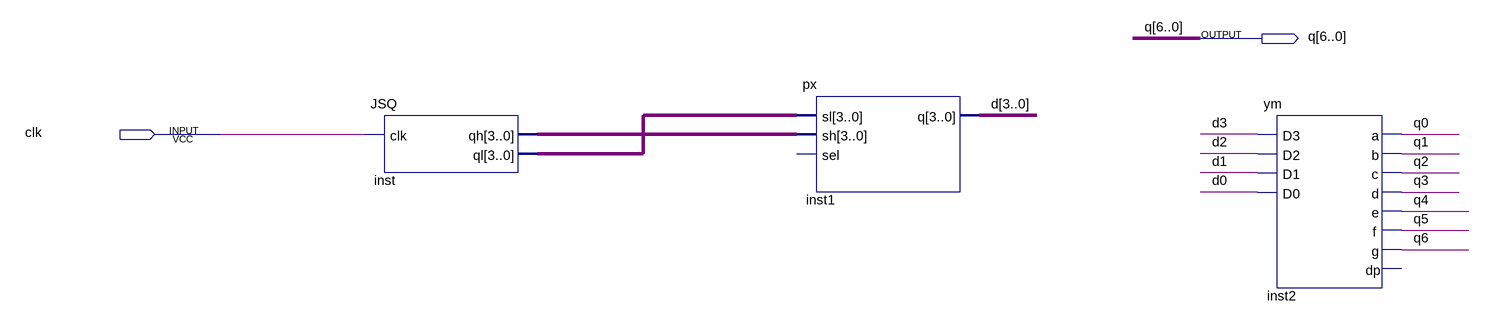
[diagram p0: schematic sheet]
// Quartus schematic digital_tube.bdf as structural Verilog: 3 symbols, 2 pins
module digital_tube (
  input  clk,
  output [6:0] q
);

  wire [3:0] d, inst_qh, inst_ql;

  JSQ inst (.clk(clk), .qh(inst_qh), .ql(inst_ql));
  px inst1 (.sl(inst_ql), .sh(inst_qh), .q(d));  // open: sel
  ym inst2 (
    .D3(d[3]), .D2(d[2]), .D1(d[1]), .D0(d[0]), .a(q[0]), .b(q[1]), .c(q[2]), .d(q[3]), .e(q[4]), .f(q[5]),
    .g(q[6]));  // open: dp
endmodule
